# Altium project USB_TO_SPI.PrjPcb
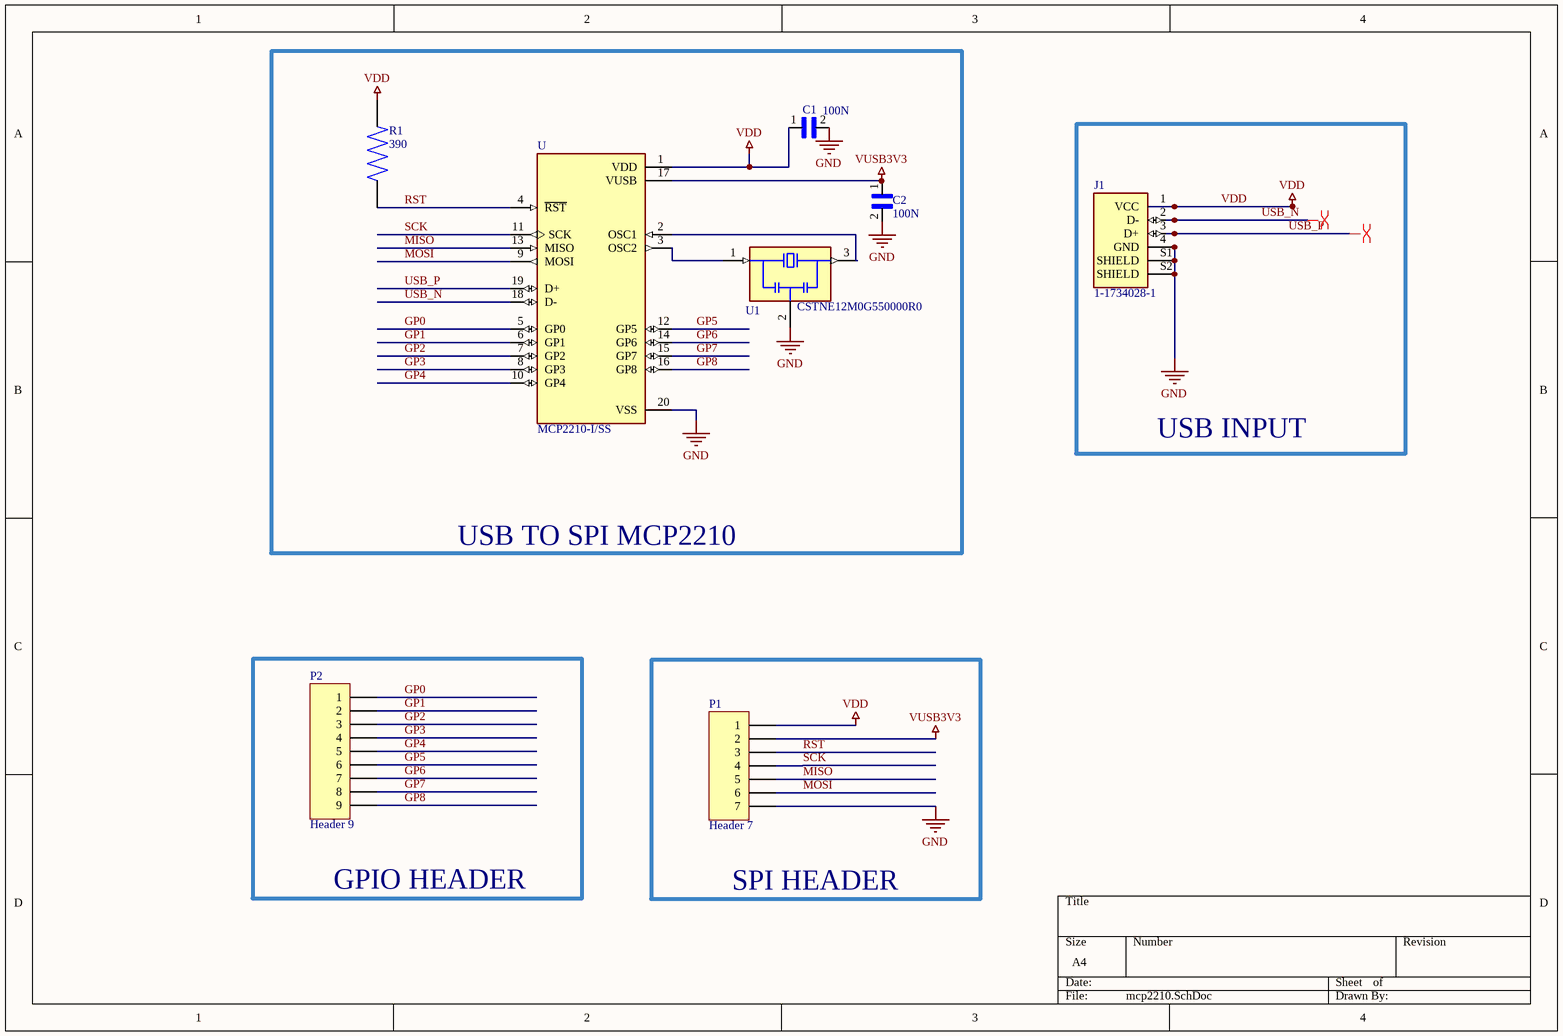
[diagram p0: mcp2210.SchDoc]
1 sheet, 8 parts. Net scope: global (net labels, ports and power ports of the same name join across sheets).
Board file: UART_TO_SPI.PcbDoc

## Sheet mcp2210.SchDoc
size A4; SheetNumber: 1; SheetTotal: 1

### Parts
C1  100N  [CAPC1005X55N]
C2  100N  [CAPC1005X55N]
J1  1-1734028-1  [TE_1-1734028-1]
P1  Header 7  [HDR1X7]
P2  Header 9  [HDR1X9]
R1  390  [RES_ERJ3EKF3900V]
U  MCP2210-I/SS  [SOP65P780X200-20N]
U1  CSTNE12M0G550000R0  [OSC_CSTNE12M0G550000R0]

### Blocks framed on the sheet
USB TO SPI MCP2210: C1 C2 R1 U U1
USB INPUT: J1
GPIO HEADER: P2
SPI HEADER: P1

### Nets
GND: C1.2 C2.2 J1.4(GND) J1.S1(SHIELD) J1.S2(SHIELD) P1.7 U.20(VSS) U1.2(GND)
VDD: C1.1 J1.1(VCC) P1.1 R1.2 U.1(VDD)
VUSB3V3: C2.1 P1.2 U.17(VUSB)
GP0: P2.1 U.5(GP0)
GP1: P2.2 U.6(GP1)
GP2: P2.3 U.7(GP2)
GP3: P2.4 U.8(GP3)
GP4: P2.5 U.10(GP4)
GP5: P2.6 U.12(GP5)
GP6: P2.7 U.14(GP6)
GP7: P2.8 U.15(GP7)
GP8: P2.9 U.16(GP8)
MISO: P1.5 U.13(MISO)
MOSI: P1.6 U.9(MOSI)
RST: P1.3 R1.1 U.4(~{RST})
SCK: P1.4 U.11(SCK)
USB_N: J1.2(D-) U.18(D-)
USB_P: J1.3(D+) U.19(D+)
NetU_2: U.2(OSC1) U1.3(OUT)
NetU_3: U.3(OSC2) U1.1(IN)

### Layout directives
differential pair: USB_N, USB_P

### Library data of the parts
C1 C2 = GRM155R71C104KA88D: SMD Capacitor X7R_EIA_ with Capacitance: 0.10uF Tol. 10%. Rated Voltage: 16Vdc; MF: Murata; Package: 1005 Taiyo Yuden; Value: *; MP: GRM155R71C104KA88D; SnapEDA_Link: https://www.snapeda.com/parts/GRM155R71C104KA88D/Murata%20Electronics%20North%20America/view-part/4750/?ref=snap
J1 = 1-1734028-1: Conn USB 2.0 Type A PL 4 POS Solder RA SMD 4 Terminal 1 Port T/R; Product_Type: Connector; Centerline_Pitch: 2 mm[.078 in]; MF: TE Connectivity; Number_of_Positions: 4; SnapEDA_Link: https://www.snapeda.com/parts/1-1734028-1/TE%20Connectivity%20AMP%20Connectors/view-part/889803/?ref=snap; TE_purchase_URL: https://www.te.com/usa-en/product-1-1734028-1.html?te_bu=Cor&te_type=disp&te_campaign=seda_glo_cor-seda-global-disp-prtnr-fy19-seda-model-bom-cta_sma-317_1&elqCampaignId=32493; Digi-Key_Part_Number: A122942CT-ND; Digi-Key_Purchase_URL: https://www.digikey.hk/product-detail/en/te-connectivity-amp-connectors/1-1734028-1/A122942CT-ND/5419414?utm_source=snapeda&utm_medium=aggregator&utm_campaign=symbol; MP: 1-1734028-1; Package: None; Value: *
P1 = Header 7: Header, 7-Pin; LatestRevisionDate: 17-Jul-2002; LatestRevisionNote: Re-released for DXP Platform.; Publisher: Altium Limited
P2 = Header 9: Header, 9-Pin; LatestRevisionDate: 17-Jul-2002; LatestRevisionNote: Re-released for DXP Platform.; Publisher: Altium Limited
R1 = ERJ3EKF3900V: Value: *; Availability: Unavailable; Package: None; Price: None; MP: ERJ3EKF3900V
U = MCP2210-I/SS: USB Bridge, USB to SPI USB 2.0 SPI Interface 20-SSOP; MF: Microchip; Availability: Unavailable; Price: None; Package: SSOP-20 Microchip; Value: *; SnapEDA_Link: https://www.snapeda.com/parts/MCP2210-I/SS/Microchip/view-part/275317/?ref=snap; MP: MCP2210-I/SS
U1 = CSTNE12M0G550000R0: 12MHz Ceramic Resonator Built in Capacitor 33pF Â±0.2% 30 Ohms -40Â°C ~ 85Â°C Surface Mount; MF: Murata Electronics; Availability: Good; SnapEDA_Link: https://www.snapeda.com/parts/CSTNE12M0G550000R0/Murata%20Electronics%20North%20America/view-part/2778735/?ref=snap; Check_prices: https://www.snapeda.com/parts/CSTNE12M0G550000R0/Murata%20Electronics%20North%20America/view-part/2778735/?ref=eda; Value: *; Package: SMD-3 Murata; Purchase-URL: https://pricing.snapeda.com/search/part/CSTNE12M0G550000R0/?ref=eda; MP: CSTNE12M0G550000R0; Price: None